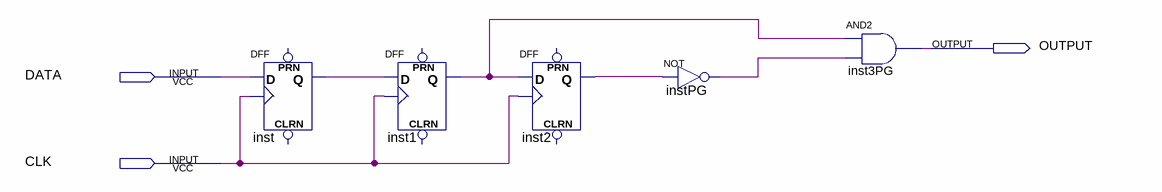
[diagram p0: schematic sheet]
// Quartus schematic pulseGen.bdf as structural Verilog: 5 symbols, 3 pins
module pulseGen (
  input  DATA,
  input  CLK,
  output OUTPUT
);

  wire inst1_q, inst2_q, inst_q, instPG_out;

  DFF inst (.CLK(CLK), .D(DATA), .Q(inst_q));  // open: CLRN, PRN
  DFF inst1 (.CLK(CLK), .D(inst_q), .Q(inst1_q));  // open: CLRN, PRN
  DFF inst2 (.CLK(CLK), .D(inst1_q), .Q(inst2_q));  // open: CLRN, PRN
  not instPG (instPG_out, inst2_q);
  and inst3PG (OUTPUT, inst1_q, instPG_out);
endmodule
